# Altium schematic sheet USB.SchDoc
size A3; SheetNumber: 2; SheetTotal: 14; SPICEModelCacheQEWUXKYK: <root> / <DocumentId>QEWUXKYK</DocumentId> / </root>
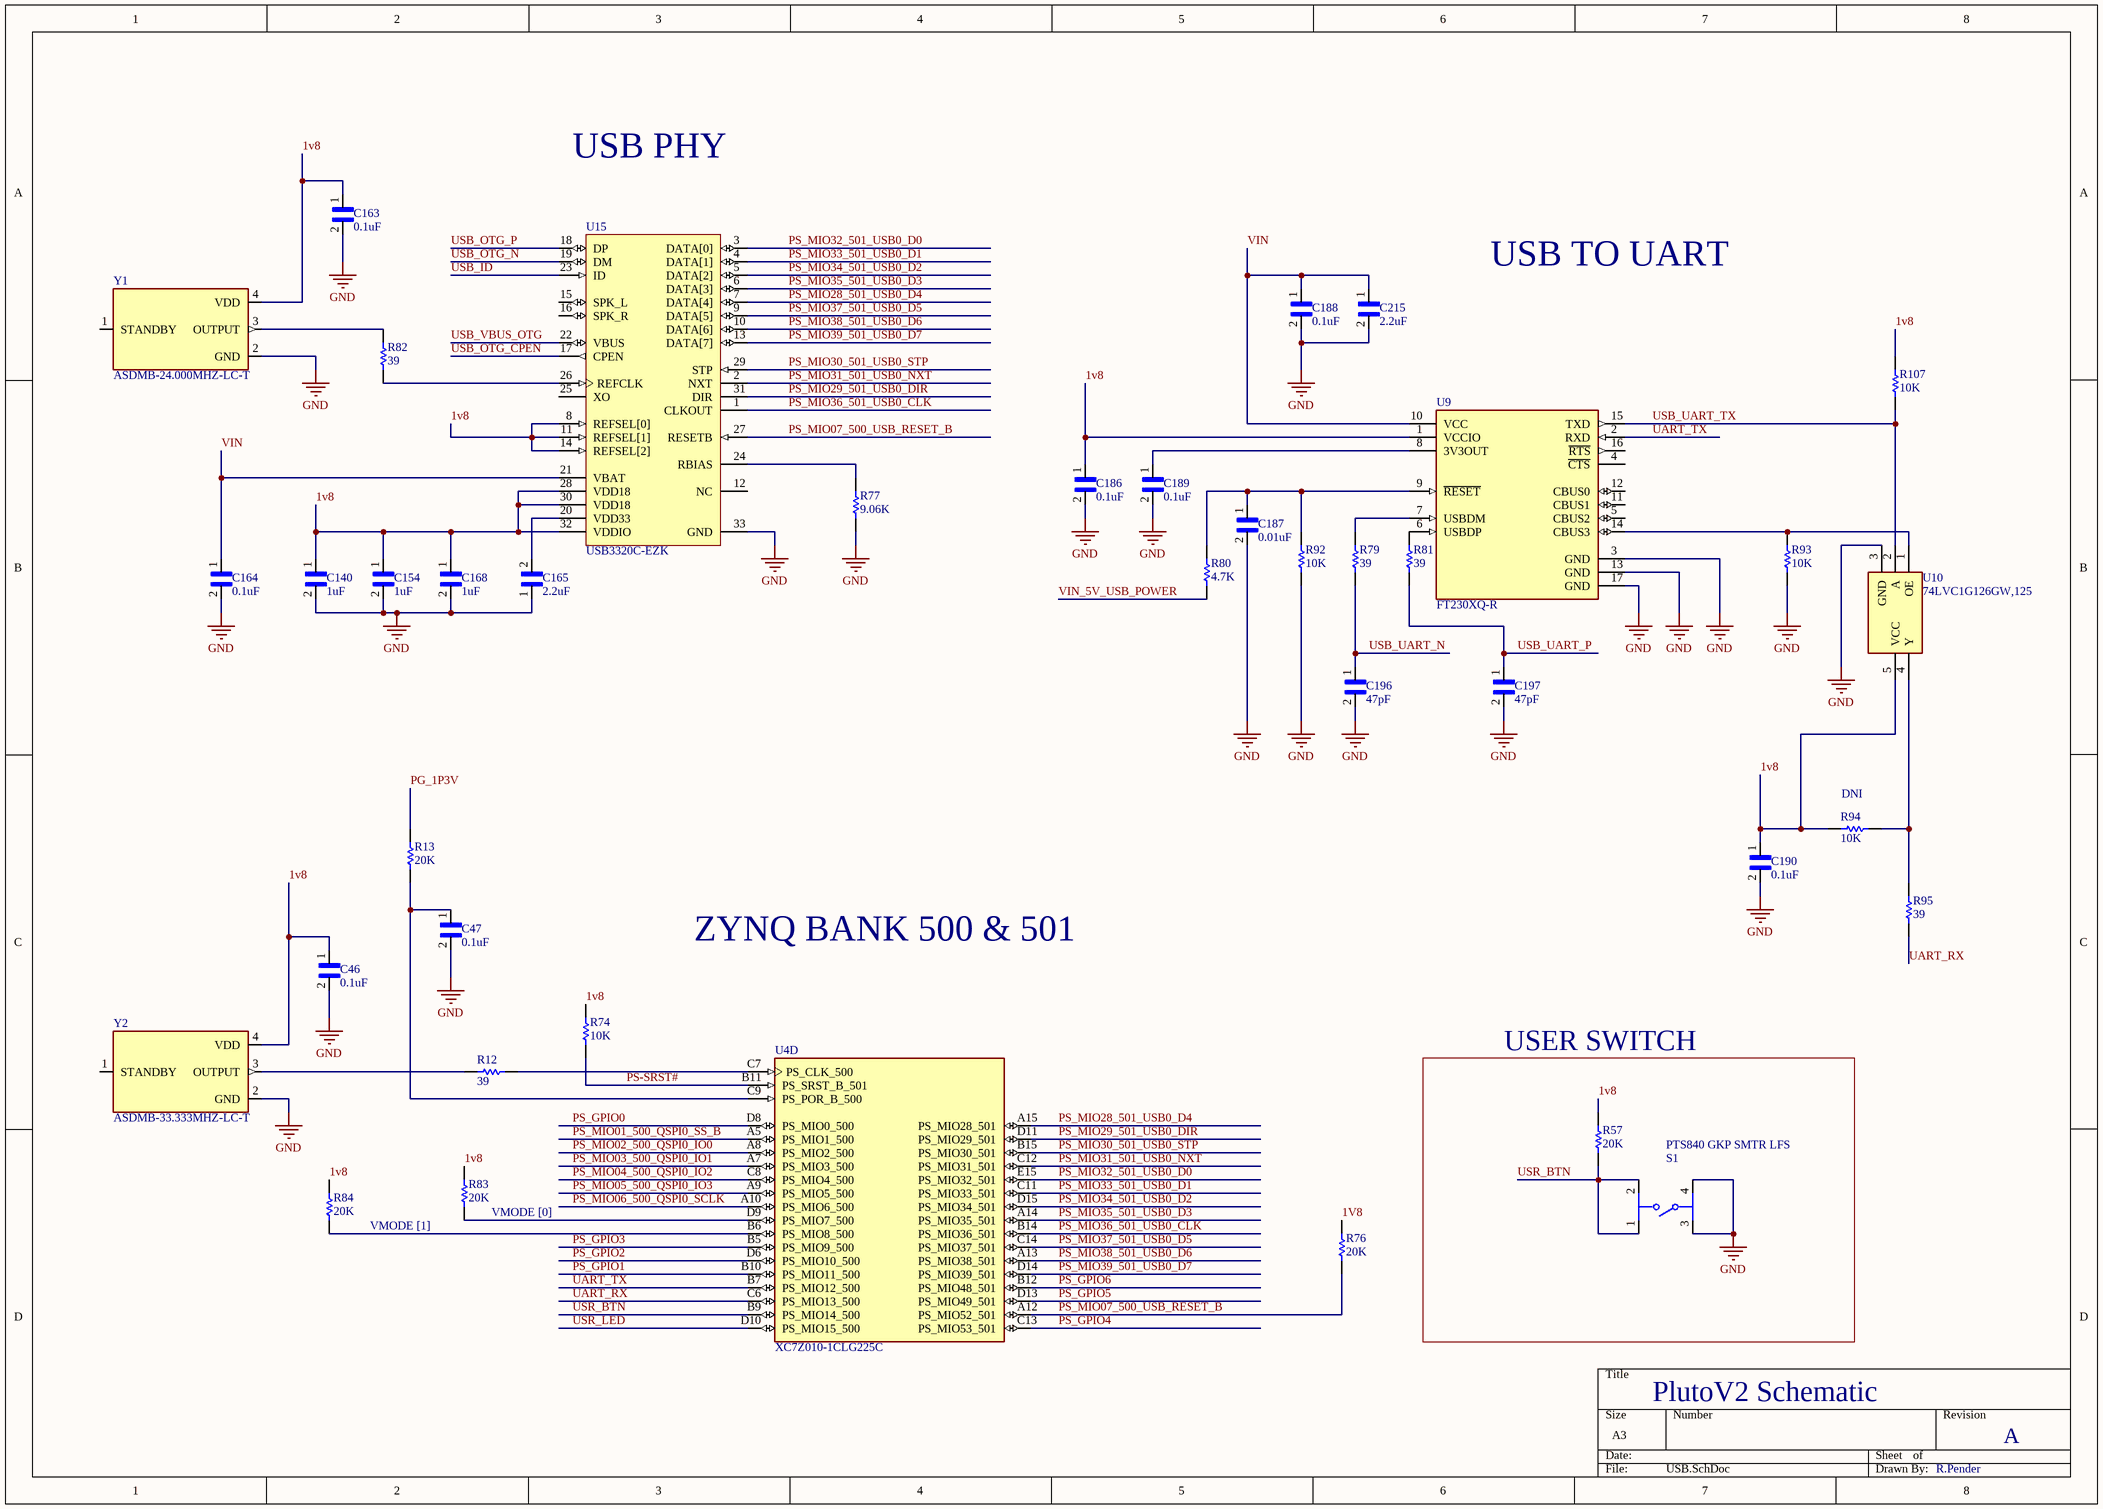
[diagram p0: USB.SchDoc]

## Parts
C46  0.1uF  [CAPC0603X33N]
C47  0.1uF  [CAPC0603X33N]
C140  1uF  [CAPC1005X55N]
C154  1uF  [CAPC1005X55N]
C163  0.1uF  [CAPC0603X33N]
C164  0.1uF  [CAPC0603X33N]
C165  2.2uF  [CAPC1608X100N]
C168  1uF  [CAPC1005X55N]
C186  0.1uF  [CAPC1005X55N]
C187  0.01uF  [CAPC0603X33N]
C188  0.1uF  [CAPC0603X33N]
C189  0.1uF  [CAPC0603X33N]
C190  0.1uF  [CAPC0603X33N]
C196  47pF  [CAPC1005X55N]
C197  47pF  [CAPC1005X55N]
C215  2.2uF  [CAPC1608X100N]
R12  39  [2-0402]
R13  20K  [2-0402]
R57  20K  [2-0402]
R74  10K  [2-0402]
R76  20K  [2-0402]
R77  9.06K  [2-0402]
R79  39  [2-0402]
R80  4.7K  [2-0402]
R81  39  [2-0402]
R82  39  [2-0402]
R83  20K  [2-0402]
R84  20K  [2-0402]
R92  10K  [2-0402]
R93  10K  [2-0402]
R94  10K  [2-0402]
R95  39  [2-0402]
R107  10K  [2-0402]
S1  PTS840 GKP SMTR LFS  [FP-PTS840_GKP_SMTR_LFS-MFG]
U4  XC7Z010-1CLG225C  [BGA225C80P15X15_1300X1300X150]  (part D of 6)
U9  FT230XQ-R  [FP-QFN-16-MFG]
U10  74LVC1G126GW,125  [SOT65P212X110-5N]
U15  USB3320C-EZK  [MCHP-QFN-32-5x5_V2]
Y1  ASDMB-24.000MHZ-LC-T  [XTAL_ASDMB-24.000MHZ-LC-T]
Y2  ASDMB-33.333MHZ-LC-T  [XTAL_ASDMB-24.000MHZ-LC-T]

## Blocks framed on the sheet
USER SWITCH: R57 S1

## Nets
GND: C46.2 C47.2 C140.2 C154.2 C163.2 C164.2 C165.1 C168.2 C186.2 C187.2 C188.2 C189.2 C190.2 C196.2 C197.2 C215.2 R77.1 R92.1 R93.2 S1.3 S1.4 U9.3(GND) U9.13(GND) U9.17(GND) U10.3(GND) U15.33(GND) Y1.2(GND) Y2.2(GND)
1v8: C46.1 C140.1 C154.1 C163.1 C168.1 C186.1 C190.1 R57.1 R74.2 R76.2 R83.1 R84.1 R94.2 R107.1 U9.1(VCCIO) U10.5(VCC) U15.8(REFSEL[0]) U15.11(REFSEL[1]) U15.14(REFSEL[2]) U15.28(VDD18) U15.30(VDD18) U15.32(VDDIO) Y1.4(VDD) Y2.4(VDD)
PG_1P3V: R13.2
PS-SRST#: R74.1 U4.B11(PS_SRST_B_501)
PS_GPIO0: U4.D8(PS_MIO0_500)
PS_GPIO1: U4.B10(PS_MIO11_500)
PS_GPIO2: U4.D6(PS_MIO10_500)
PS_GPIO3: U4.B5(PS_MIO9_500)
PS_GPIO4: U4.C13(PS_MIO53_501)
PS_GPIO5: U4.D13(PS_MIO49_501)
PS_GPIO6: U4.B12(PS_MIO48_501)
PS_MIO01_500_QSPI0_SS_B: U4.A5(PS_MIO1_500)
PS_MIO02_500_QSPI0_IO0: U4.A8(PS_MIO2_500)
PS_MIO03_500_QSPI0_IO1: U4.A7(PS_MIO3_500)
PS_MIO04_500_QSPI0_IO2: U4.C8(PS_MIO4_500)
PS_MIO05_500_QSPI0_IO3: U4.A9(PS_MIO5_500)
PS_MIO06_500_QSPI0_SCLK: U4.A10(PS_MIO6_500)
PS_MIO07_500_USB_RESET_B: R76.1 U4.A12(PS_MIO52_501) U15.27(RESETB)
PS_MIO28_501_USB0_D4: U4.A15(PS_MIO28_501) U15.7(DATA[4])
PS_MIO29_501_USB0_DIR: U4.D11(PS_MIO29_501) U15.31(DIR)
PS_MIO30_501_USB0_STP: U4.B15(PS_MIO30_501) U15.29(STP)
PS_MIO31_501_USB0_NXT: U4.C12(PS_MIO31_501) U15.2(NXT)
PS_MIO32_501_USB0_D0: U4.E15(PS_MIO32_501) U15.3(DATA[0])
PS_MIO33_501_USB0_D1: U4.C11(PS_MIO33_501) U15.4(DATA[1])
PS_MIO34_501_USB0_D2: U4.D15(PS_MIO34_501) U15.5(DATA[2])
PS_MIO35_501_USB0_D3: U4.A14(PS_MIO35_501) U15.6(DATA[3])
PS_MIO36_501_USB0_CLK: U4.B14(PS_MIO36_501) U15.1(CLKOUT)
PS_MIO37_501_USB0_D5: U4.C14(PS_MIO37_501) U15.9(DATA[5])
PS_MIO38_501_USB0_D6: U4.A13(PS_MIO38_501) U15.10(DATA[6])
PS_MIO39_501_USB0_D7: U4.D14(PS_MIO39_501) U15.13(DATA[7])
UART_RX: R95.2 U4.C6(PS_MIO13_500)
UART_TX: U4.B7(PS_MIO12_500) U9.2(RXD)
USB_ID: U15.23(ID)
USB_OTG_CPEN: U15.17(CPEN)
USB_OTG_N: U15.19(DM)
USB_OTG_P: U15.18(DP)
USB_UART_N: C196.1 R79.2
USB_UART_P: C197.1 R81.1
USB_UART_TX: R107.2 U9.15(TXD) U10.2(A)
USB_VBUS_OTG: U15.22(VBUS)
USR_BTN: R57.2 S1.1 S1.2 U4.B9(PS_MIO14_500)
USR_LED: U4.D10(PS_MIO15_500)
VIN: C164.1 C188.1 C215.1 U9.10(VCC) U15.21(VBAT)
VIN_5V_USB_POWER: R80.1
NetC47_1: C47.1 R13.1 U4.C9(PS_POR_B_500)
NetC165_2: C165.2 U15.20(VDD33)
NetC187_1: C187.1 R80.2 R92.2 U9.9(~{RESET})
NetC189_1: C189.1 U9.8(3V3OUT)
NetR12_1: R12.1 Y2.3(OUTPUT)
NetR12_2: R12.2 U4.C7(PS_CLK_500)
NetR77_2: R77.2 U15.24(RBIAS)
NetR79_1: R79.1 U9.7(USBDM)
NetR81_2: R81.2 U9.6(USBDP)
NetR82_1: R82.1 U15.26(REFCLK)
NetR82_2: R82.2 Y1.3(OUTPUT)
NetR83_2: R83.2 U4.D9(PS_MIO7_500)
NetR84_2: R84.2 U4.B6(PS_MIO8_500)
NetR93_1: R93.1 U9.14(CBUS3) U10.1(OE)
NetR94_1: R94.1 R95.1 U10.4(Y)

Not connected (* = marked no-connect by the designer): U9 4(~{CTS}) 5(CBUS2) 11(CBUS1) 12(CBUS0) 16(~{RTS}); U15 12(NC) 15(SPK_L) 16(SPK_R) 25(XO); Y1 1(STANDBY); Y2 1(STANDBY)

## Notes on the sheet
- USB PHY
- USB TO UART
- (near R94) DNI
- ZYNQ BANK 500 & 501
- VMODE [1]
- (near R83) VMODE [0]
- PlutoV2 Schematic
- A
- R.Pender

## Library data of the parts
C46 C47 C163 C164 C188-C190 = GRM033R61C104ME84D: CAP 0.1UF 16VDC X5R 20% SMD 0201 PAPER TAPE; Package: None; Price: None; Value: *; MP: GRM033R61C104ME84D; Availability: Unavailable
C140 C154 C168 C186 = EMK105BJ105KV-F: 1ÂµF Â± 10% 16V Condensateur cÃ©ramique X5R 0402 _1005 mÃ©trique_; MF: Taiyo Yuden; SnapEDA_Link: https://www.snapeda.com/parts/EMK105BJ105KV-F/Taiyo%20Yuden/view-part/1766709/?ref=snap; Digi-Key_Part_Number: 587-2477-1-ND; Package: 1005 Taiyo Yuden; Value: *; Digi-Key_Purchase_URL: https://www.digikey.com/product-detail/en/taiyo-yuden/EMK105BJ105KV-F/587-2477-1-ND/2230343?utm_source=snapeda&utm_medium=aggregator&utm_campaign=symbol; MP: EMK105BJ105KV-F
C165 C215 = GRM188R61H225KE11J: SMD Capacitor X5R(EIA) with Capacitance: 2.2uF Tol. 10%. Rated Voltage: 50Vdc; MF: Murata; Availability: Warning; Package: 1608 Murata; Purchase-URL: https://pricing.snapeda.com/search/part/GRM188R61H225KE11J/?ref=eda; MP: GRM188R61H225KE11J; SnapEDA_Link: https://www.snapeda.com/parts/GRM188R61H225KE11J/Murata/view-part/4377089/?ref=snap; Price: None; Check_prices: https://www.snapeda.com/parts/GRM188R61H225KE11J/Murata/view-part/4377089/?ref=eda; Value: *
C187 = GRM033R71A103KA01D: SMD Capacitor X7R(EIA) with Capacitance: 10000pF Tol. 10%. Rated Voltage: 10Vdc; MF: Murata; Package: 0603 Taiyo Yuden; MP: GRM033R71A103KA01D; Value: *; SnapEDA_Link: https://www.snapeda.com/parts/GRM033R71A103KA01D/Murata/view-part/4379446/?ref=snap; Availability: Unavailable; Price: None; Check_prices: https://www.snapeda.com/parts/GRM033R71A103KA01D/Murata/view-part/4379446/?ref=eda
C196 C197 = GCM1555C1H470JA16D: 47pF Â±5% 50V Ceramic Capacitor C0G, NP0 0402 (1005 Metric); MF: Murata; Purchase-URL: https://pricing.snapeda.com/search/part/GCM1555C1H470JA16D/?ref=eda; Package: 1005 Taiyo Yuden; MP: GCM1555C1H470JA16D; Value: *; SnapEDA_Link: https://www.snapeda.com/parts/GCM1555C1H470JA16D/Murata+Electronics+North+America/view-part/?ref=snap; Digi-Key_Part_Number: 490-10670-2-ND; Check_prices: https://www.snapeda.com/parts/GCM1555C1H470JA16D/Murata+Electronics+North+America/view-part/?ref=eda
R12 R79 R81 R82 R95 = ERJ2GE: Thick Film Chip Resistor, 1 Ohm to 2.2M Ohm Range, 5% Tolerance, 0402 Size, 0.063 W; Note: If flow soldering, adjust pad width of PCB Footprint to 0.7 - 0.8 times the width of the resistor.; Published: 17-Dec-2003; LatestRevisionDate: 19-Mar-2004; LatestRevisionNote: Silkscreen size reduced.; PackageDocument: Mar-2003; PackageReference: 2-0402; Publisher: Altium Limited; Code_IPC: 1005 [0402]; ComponentLink1Description: Manufacturer Link; ComponentLink1URL: http://www.panasonic.com/industrial/components/resistive_products.htm; ComponentLink2Description: Datasheet; ComponentLink2URL: http://www.panasonic.com/industrial/components/pdf/AOA0000CE1.pdf
R13 R57 R74 R76 R77 R80 R83 R84 R92-R94 R107 = ERJ2RK: Precision Thick Film Chip Resistor, 10 Ohm to 1M Ohm Range, 1% and 0.5% Tolerance, 0402 Size, 0.063 W; Published: 17-Dec-2003; LatestRevisionDate: 19-Mar-2004; LatestRevisionNote: Silkscreen size reduced.; PackageDocument: Mar-2003; PackageReference: 2-0402; Publisher: Altium Limited; Code_IPC: 1005 [0402]; ComponentLink1Description: Manufacturer Link; ComponentLink1URL: http://www.panasonic.com/industrial/components/resistive_products.htm; ComponentLink2Description: Datasheet; ComponentLink2URL: http://www.panasonic.com/industrial/components/pdf/AOA0000CE2.pdf
S1 = CMP-10040-000012-1: SWITCH TACTILE SPST-NO 0.05A 12V; Manufacturer: C&K Components; Electromechanical Life: 100000Cycles; Contact Current Rating: 50mA; Operating Force: 220gf; Standoff Height: 0mm; Contact Resistance: 500mΩ; Temperature Range High: +85°C; Automotive: No; Height: 1.35mm; Lead Free: Yes; Device Class L1: Electromechanical; Temperature: -40°C to +85°C; Digikey Description: SWITCH TACTILE SPST-NO 0.05A 12V; ComponentLink2Description: Datasheet; Category: Switch; Temperature Range Low: -40°C; Manufacturer Part Number: PTS840 GKP SMTR LFS; Throw Configuration: SPST-NO; Package: PTS840 GKP SMTR LFS; Device Class L2: Switches; Mouser Description: Tactile Switches; Voltage Rating Dc: 12V; ComponentLink2URL: https://www.ckswitches.com/media/1477/pts840.pdf; Octopart: https://octopart.com/pts840gkpsmtrlfs-c%26k+components-29380303; Device Class L3: Tactile Switches; RoHS: TRUE
U4 = XC7Z010-1CLG225C: Dual ARMÂ® CortexÂ®-A9 MPCoreâ„¢ with CoreSightâ„¢ System On Chip _SOC_ IC ZynqÂ®-7000 Artixâ„¢-7 FPGA, 28K Logic Cells 667MHz 225-CSPBGA _13x13_; MF: Xilinx Inc.; Value: *; SnapEDA_Link: https://www.snapeda.com/parts/XC7Z010-1CLG225C/Xilinx%20Inc./view-part/45778/?ref=snap; Digi-Key_Part_Number: 122-1855-ND; Package: CSPBGA-225 Xilinx; Digi-Key_Purchase_URL: https://www.digikey.by/product-detail/en/xilinx-inc/XC7Z010-1CLG225C/122-1855-ND/3925788?utm_source=snapeda&utm_medium=aggregator&utm_campaign=symbol; MP: XC7Z010-1CLG225C
U9 = CMP-0248-00010-3: IC USB SERIAL BASIC UART 16QFN; Number of Channels: 1; Data Rate: 12Mbps; Operating Supply Current: 8mA; Max Supply Voltage: 5.5V; Operating Supply Voltage: 5V; Min Supply Voltage: 2.97V; Width: 4mm; Length: 4mm; Height: 0.75mm; Max Operating Temperature: 85°C; Interface: USB; Min Operating Temperature: -40°C; Package Quantity: 5000; Lead Free: Lead Free; Number of Pins: 16; Case/Package: QFN; Weight: 0.002014oz; Packaging: Tape and Reel; Mount: Surface Mount
U10 = 74LVC1G126GW,125: Integrated Circuit; Manufacturer_Name: Nexperia; Datasheet Link: https://assets.nexperia.com/documents/data-sheet/74LVC1G126.pdf; Height: 1.1mm; Manufacturer_Part_Number: 74LVC1G126GW,125
U15 = CMP-0186-00335-1: Highly Integrated Full Featured Hi-Speed USB 2.0 ULPI Transceiver, 1.8 to 3.3 V, -40 to 85 degC, 32-Pin QFN (QFN-3304), RoHS, Tray; Manufacturer: Microchip; VVBAT: 3.1 to 5.5 V; REFCLK Frequency@ULPI Input Clock Mode: 60 MHz; Cpin: 4 pF Max.; VDD33: 3 to 3.6 V; Mounting Technology: Surface Mount; I/O Voltage: 1.8 to 3.3 V; ComponentLink3URL: http://ww1.microchip.com/downloads/en/DeviceDoc/00001792A.pdf; PackageDescription: 32-Pin Quad Flat Non-Leaded Package, Body 5 x 5 mm, Pitch 0.5 mm; ComponentLink2URL: http://ww1.microchip.com/downloads/en/DeviceDoc/00001792A.pdf; Temperature Range: -40 to 85 degC; ComponentLink2Description: Datasheet; ComponentLink1URL: www.microchip.com/; ComponentLink3Description: Package Specification; Packing: Tray; ComponentLink1Description: Manufacturer URL; PartNumber: USB3320C-EZK; PackageVersion: Rev. H; DatasheetVersion: DS00001792A; RoHS: TRUE
Y1 Y2 = ASDMB-24.000MHZ-LC-T: 24MHz XO _Standard_ LVCMOS Oscillator 1.8V ~ 3.3V Standby _Power Down_ 4-SMD, No Lead; MF: Abracon LLC; Availability: Unavailable; SnapEDA_Link: https://www.snapeda.com/parts/ASDMB-24.000MHZ-LC-T/Abracon%20LLC/view-part/339168/?ref=snap; Price: None; Value: *; MP: ASDMB-24.000MHZ-LC-T; Package: SMD-4 Abracon LLC